# Altium project TrafficLight.PrjPCB
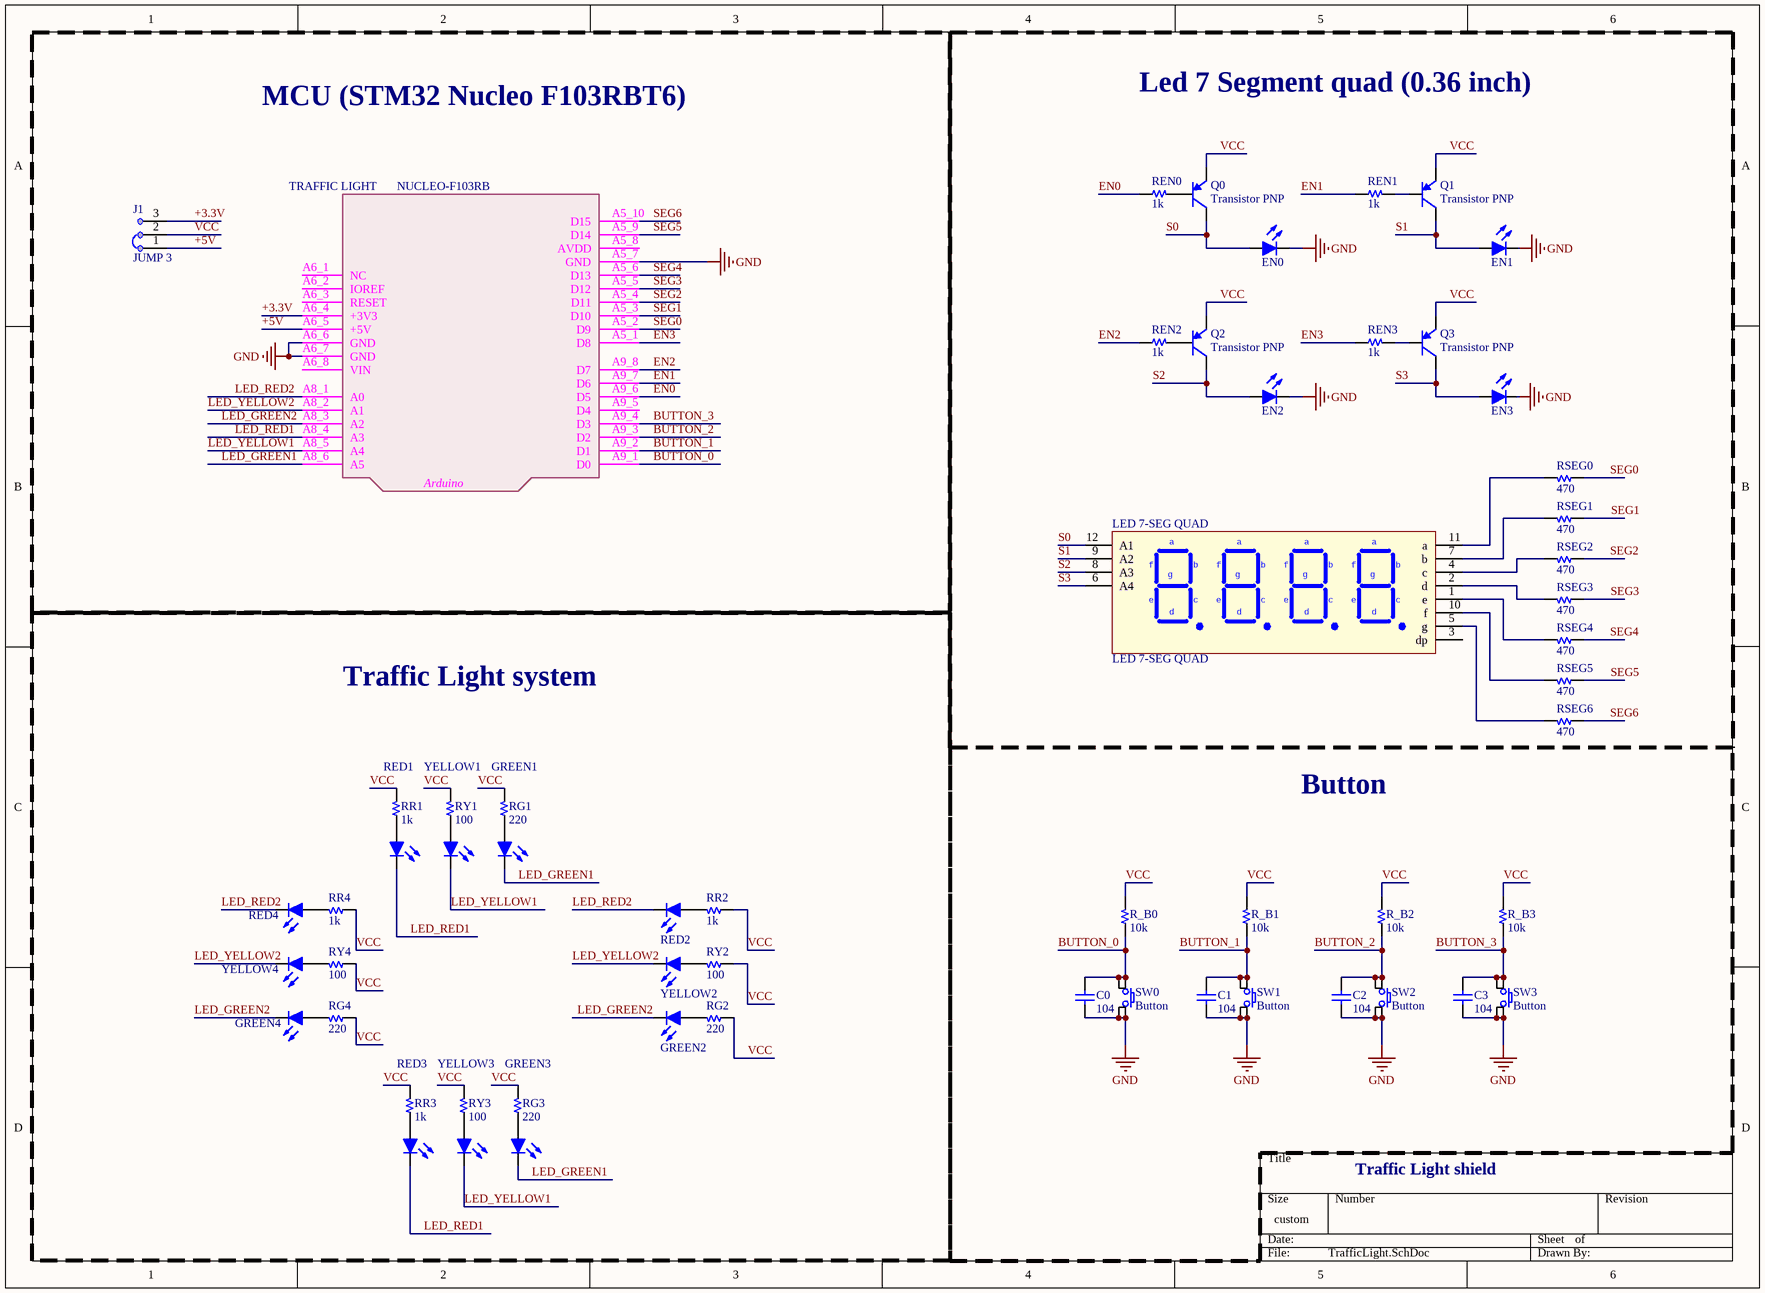
[diagram p0: TrafficLight.SchDoc]
1 sheet, 58 parts. Net scope: global (net labels, ports and power ports of the same name join across sheets).
Board file: TrafficLight.PcbDoc

## Sheet TrafficLight.SchDoc
size 330 x 241 mm

### Parts
C0  104  [C 0603]
C1  104  [C 0603]
C2  104  [C 0603]
C3  104  [C 0603]
EN0  Led  [Led 0603 - red]  (value not drawn)
EN1  Led  [Led 0603 - red]  (value not drawn)
EN2  Led  [Led 0603 - red]  (value not drawn)
EN3  Led  [Led 0603 - red]  (value not drawn)
GREEN1  Led  [LED 3MM - green]  (value not drawn)
GREEN2  Led  [LED 3MM - green]  (value not drawn)
GREEN3  Led  [LED 3MM - green]  (value not drawn)
GREEN4  Led  [LED 3MM - green]  (value not drawn)
J1  JUMP 3  [JUMP3]  (no BOM)
LED_7-SEG_QUAD  LED 7-SEG QUAD  [LED/7SEG/0.36/QUAD 3641]
Q0  Transistor PNP  [SOT-23]
Q1  Transistor PNP  [SOT-23]
Q2  Transistor PNP  [SOT-23]
Q3  Transistor PNP  [SOT-23]
R_B0  10k  [R 0603]
R_B1  10k  [R 0603]
R_B2  10k  [R 0603]
R_B3  10k  [R 0603]
RED1  Led  [LED 3MM - red]  (value not drawn)
RED2  Led  [LED 3MM - red]  (value not drawn)
RED3  Led  [LED 3MM - red]  (value not drawn)
RED4  Led  [LED 3MM - red]  (value not drawn)
REN0  1k  [R 0603]
REN1  1k  [R 0603]
REN2  1k  [R 0603]
REN3  1k  [R 0603]
RG1  220  [R 0603]
RG2  220  [R 0603]
RG3  220  [R 0603]
RG4  220  [R 0603]
RR1  1k  [R 0603]
RR2  1k  [R 0603]
RR3  1k  [R 0603]
RR4  1k  [R 0603]
RSEG0  470  [R 0603]
RSEG1  470  [R 0603]
RSEG2  470  [R 0603]
RSEG3  470  [R 0603]
RSEG4  470  [R 0603]
RSEG5  470  [R 0603]
RSEG6  470  [R 0603]
RY1  100  [R 0603]
RY2  100  [R 0603]
RY3  100  [R 0603]
RY4  100  [R 0603]
SW0  Button  [SW/4/06MM]
SW1  Button  [SW/4/06MM]
SW2  Button  [SW/4/06MM]
SW3  Button  [SW/4/06MM]
TRAFFIC_LIGHT  NUCLEO-F103RB  [NUCLEO]
YELLOW1  Led  [LED 3MM - yellow]  (value not drawn)
YELLOW2  Led  [LED 3MM - yellow]  (value not drawn)
YELLOW3  Led  [LED 3MM - yellow]  (value not drawn)
YELLOW4  Led  [LED 3MM - yellow]  (value not drawn)

### Nets
GND: C0.2 C1.2 C2.2 C3.2 EN0.2(K) EN1.2(K) EN2.2(K) EN3.2(K) SW0.3 SW0.4 SW1.3 SW1.4 SW2.3 SW2.4 SW3.3 SW3.4 TRAFFIC_LIGHT.A5_7(GND) TRAFFIC_LIGHT.A6_6(GND) TRAFFIC_LIGHT.A6_7(GND)
+3.3V: J1.3 TRAFFIC_LIGHT.A6_4(+3V3)
+5V: J1.1 TRAFFIC_LIGHT.A6_5(+5V)
BUTTON_0: C0.1 R_B0.1 SW0.1 SW0.2 TRAFFIC_LIGHT.A9_1(D0)
BUTTON_1: C1.1 R_B1.1 SW1.1 SW1.2 TRAFFIC_LIGHT.A9_2(D1)
BUTTON_2: C2.1 R_B2.1 SW2.1 SW2.2 TRAFFIC_LIGHT.A9_3(D2)
BUTTON_3: C3.1 R_B3.1 SW3.1 SW3.2 TRAFFIC_LIGHT.A9_4(D3)
EN0: REN0.1 TRAFFIC_LIGHT.A9_6(D5)
EN1: REN1.1 TRAFFIC_LIGHT.A9_7(D6)
EN2: REN2.1 TRAFFIC_LIGHT.A9_8(D7)
EN3: REN3.1 TRAFFIC_LIGHT.A5_1(D8)
LED_GREEN1: GREEN1.2(K) GREEN3.2(K) TRAFFIC_LIGHT.A8_6(A5)
LED_GREEN2: GREEN2.2(K) GREEN4.2(K) TRAFFIC_LIGHT.A8_3(A2)
LED_RED1: RED1.2(K) RED3.2(K) TRAFFIC_LIGHT.A8_4(A3)
LED_RED2: RED2.2(K) RED4.2(K) TRAFFIC_LIGHT.A8_1(A0)
LED_YELLOW1: TRAFFIC_LIGHT.A8_5(A4) YELLOW1.2(K) YELLOW3.2(K)
LED_YELLOW2: TRAFFIC_LIGHT.A8_2(A1) YELLOW2.2(K) YELLOW4.2(K)
S0: EN0.1(A) LED_7-SEG_QUAD.12(A1) Q0.3(C)
S1: EN1.1(A) LED_7-SEG_QUAD.9(A2) Q1.3(C)
S2: EN2.1(A) LED_7-SEG_QUAD.8(A3) Q2.3(C)
S3: EN3.1(A) LED_7-SEG_QUAD.6(A4) Q3.3(C)
SEG0: RSEG0.1 TRAFFIC_LIGHT.A5_2(D9)
SEG1: RSEG1.1 TRAFFIC_LIGHT.A5_3(D10)
SEG2: RSEG2.1 TRAFFIC_LIGHT.A5_4(D11)
SEG3: RSEG3.1 TRAFFIC_LIGHT.A5_5(D12)
SEG4: RSEG4.1 TRAFFIC_LIGHT.A5_6(D13)
SEG5: RSEG5.1 TRAFFIC_LIGHT.A5_9(D14)
SEG6: RSEG6.1 TRAFFIC_LIGHT.A5_10(D15)
VCC: J1.2 Q0.2(E) Q1.2(E) Q2.2(E) Q3.2(E) R_B0.2 R_B1.2 R_B2.2 R_B3.2 RG1.2 RG2.1 RG3.2 RG4.1 RR1.2 RR2.1 RR3.2 RR4.1 RY1.2 RY2.1 RY3.2 RY4.1
NetGREEN1_1: GREEN1.1(A) RG1.1
NetGREEN2_1: GREEN2.1(A) RG2.2
NetGREEN3_1: GREEN3.1(A) RG3.1
NetGREEN4_1: GREEN4.1(A) RG4.2
NetLED_7-SEG_QUAD_1: LED_7-SEG_QUAD.1(e) RSEG4.2
NetLED_7-SEG_QUAD_2: LED_7-SEG_QUAD.2(d) RSEG3.2
NetLED_7-SEG_QUAD_4: LED_7-SEG_QUAD.4(c) RSEG2.2
NetLED_7-SEG_QUAD_5: LED_7-SEG_QUAD.5(g) RSEG6.2
NetLED_7-SEG_QUAD_7: LED_7-SEG_QUAD.7(b) RSEG1.2
NetLED_7-SEG_QUAD_10: LED_7-SEG_QUAD.10(f) RSEG5.2
NetLED_7-SEG_QUAD_11: LED_7-SEG_QUAD.11(a) RSEG0.2
NetQ0_1: Q0.1(B) REN0.2
NetQ1_1: Q1.1(B) REN1.2
NetQ2_1: Q2.1(B) REN2.2
NetQ3_1: Q3.1(B) REN3.2
NetRED1_1: RED1.1(A) RR1.1
NetRED2_1: RED2.1(A) RR2.2
NetRED3_1: RED3.1(A) RR3.1
NetRED4_1: RED4.1(A) RR4.2
NetRY1_1: RY1.1 YELLOW1.1(A)
NetRY2_2: RY2.2 YELLOW2.1(A)
NetRY3_1: RY3.1 YELLOW3.1(A)
NetRY4_2: RY4.2 YELLOW4.1(A)

Not connected (* = marked no-connect by the designer): LED_7-SEG_QUAD 3(dp); TRAFFIC_LIGHT A5_8(AVDD) A6_1(NC) A6_2(IOREF) A6_3(RESET) A6_8(VIN) A9_5(D4)

### Notes on the sheet
- Led 7 Segment quad (0.36 inch)
- MCU (STM32 Nucleo F103RBT6)
- Traffic Light system
- Button
- Traffic Light shield
- (in symbol NUCLEO_Adruino only) Arduino

### Library data of the parts
C0-C3 = Capacitor NP: Capacitor non-pol
EN0-EN3 GREEN1-GREEN4 RED1-RED4 YELLOW1-YELLOW4 = Led: Typical LED
LED_7-SEG_QUAD = LED 7-SEG QUAD 0.36inch: LED 7-SEG 0.36 QUAD RED
Q0-Q3 = Transistor PNP: PNP Bipolar Transistor
R_B0-R_B3 REN0-REN3 RG1-RG4 RR1-RR4 RSEG0-RSEG6 RY1-RY4 = Resistor
SW0-SW3 = SW SPST 4-pin: Tact switch 4-pin
TRAFFIC_LIGHT = NUCLEO_Adruino only: STM32F103RB, mbed-Enabled Development Nucleo-64 STM32F1 ARM® Cortex®-M3 MCU 32-Bit Embedded Evaluation Board; Manufacturer: STMicroelectronics; Manufacturer Product Number: NUCLEO-F103RB; BRAND: STMicroelectronics; PART NO: NUCLEO-F103RB; STOCK CODE: 497-14362-ND; SUPPLIER: digi-key; TYPE: EVAL BRD